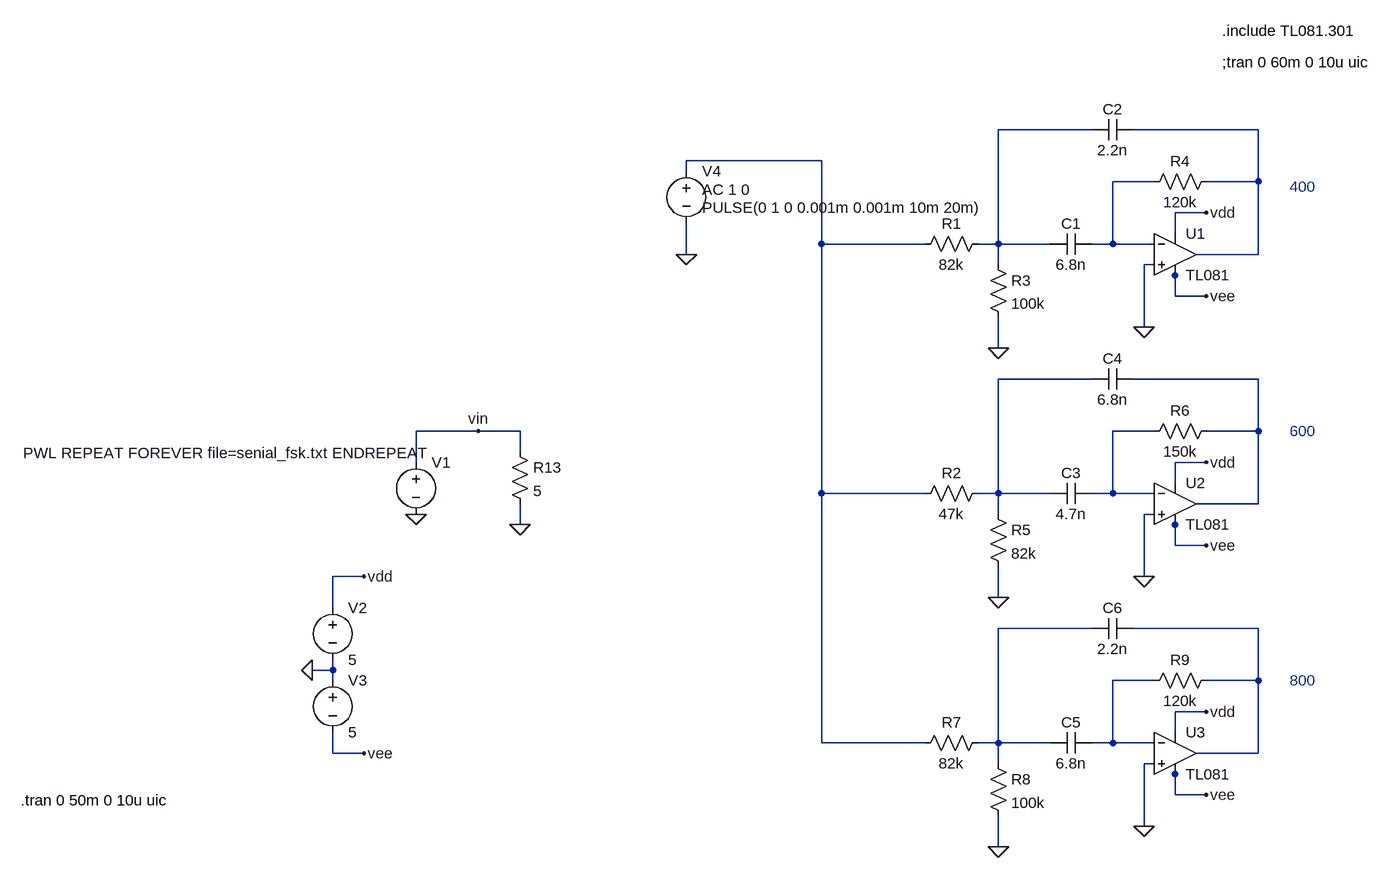
[diagram p0: schematic importar.asc]
importar.asc, the LTspice schematic file:
Version 4
SHEET 1 1032 836
WIRE -144 -544 -288 -544
WIRE 112 -544 -80 -544
WIRE -560 -496 -768 -496
WIRE -768 -480 -768 -496
WIRE -48 -464 -112 -464
WIRE 112 -464 112 -544
WIRE 112 -464 32 -464
WIRE 32 -416 -16 -416
WIRE -16 -384 -16 -416
WIRE -560 -368 -560 -496
WIRE -400 -368 -560 -368
WIRE -288 -368 -288 -544
WIRE -288 -368 -320 -368
WIRE -208 -368 -288 -368
WIRE -112 -368 -112 -464
WIRE -112 -368 -144 -368
WIRE -48 -368 -112 -368
WIRE -768 -352 -768 -400
WIRE 112 -352 112 -464
WIRE 112 -352 16 -352
WIRE -288 -336 -288 -368
WIRE -48 -336 -64 -336
WIRE -16 -320 -16 -336
WIRE -16 -288 -16 -320
WIRE 32 -288 -16 -288
WIRE -64 -240 -64 -336
WIRE -288 -208 -288 -256
WIRE -144 -160 -288 -160
WIRE 112 -160 -80 -160
WIRE -1088 -80 -1184 -80
WIRE -1024 -80 -1088 -80
WIRE -48 -80 -112 -80
WIRE 112 -80 112 -160
WIRE 112 -80 32 -80
WIRE -1024 -48 -1024 -80
WIRE -1184 -32 -1184 -80
WIRE 32 -32 -16 -32
WIRE -16 0 -16 -32
WIRE -560 16 -560 -368
WIRE -400 16 -560 16
WIRE -288 16 -288 -160
WIRE -288 16 -320 16
WIRE -208 16 -288 16
WIRE -112 16 -112 -80
WIRE -112 16 -144 16
WIRE -48 16 -112 16
WIRE 112 32 112 -80
WIRE 112 32 16 32
WIRE -288 48 -288 16
WIRE -48 48 -64 48
WIRE -1024 64 -1024 32
WIRE -16 64 -16 48
WIRE -16 96 -16 64
WIRE 32 96 -16 96
WIRE -1264 144 -1312 144
WIRE -64 144 -64 48
WIRE -288 176 -288 128
WIRE -1312 192 -1312 144
WIRE -144 224 -288 224
WIRE 112 224 -80 224
WIRE -1312 288 -1312 272
WIRE -1312 288 -1344 288
WIRE -1312 304 -1312 288
WIRE -48 304 -112 304
WIRE 112 304 112 224
WIRE 112 304 32 304
WIRE 32 352 -16 352
WIRE -16 384 -16 352
WIRE -560 400 -560 16
WIRE -400 400 -560 400
WIRE -288 400 -288 224
WIRE -288 400 -320 400
WIRE -208 400 -288 400
WIRE -112 400 -112 304
WIRE -112 400 -144 400
WIRE -48 400 -112 400
WIRE -1312 416 -1312 384
WIRE -1264 416 -1312 416
WIRE 112 416 112 304
WIRE 112 416 16 416
WIRE -288 432 -288 400
WIRE -48 432 -64 432
WIRE -16 448 -16 432
WIRE -16 480 -16 448
WIRE 32 480 -16 480
WIRE -64 528 -64 432
WIRE -288 560 -288 512
FLAG -1184 48 0
FLAG -1088 -80 vin
FLAG -1344 288 0
FLAG -1264 144 vdd
FLAG -1264 416 vee
FLAG -1024 64 0
FLAG -768 -352 0
FLAG -288 -208 0
FLAG -64 -240 0
FLAG 32 -416 vdd
FLAG 32 -288 vee
FLAG -288 176 0
FLAG -64 144 0
FLAG 32 -32 vdd
FLAG 32 96 vee
FLAG -288 560 0
FLAG -64 528 0
FLAG 32 352 vdd
FLAG 32 480 vee
SYMBOL voltage -1184 -48 R0
WINDOW 123 0 0 Left 2
WINDOW 39 0 0 Left 2
WINDOW 3 -604 2 Left 2
SYMATTR Value PWL REPEAT FOREVER file=senial_fsk.txt ENDREPEAT
SYMATTR InstName V1
SYMBOL voltage -1312 176 R0
WINDOW 123 0 0 Left 2
WINDOW 39 0 0 Left 2
SYMATTR InstName V2
SYMATTR Value 5
SYMBOL voltage -1312 288 R0
WINDOW 123 0 0 Left 2
WINDOW 39 0 0 Left 2
SYMATTR InstName V3
SYMATTR Value 5
SYMBOL res -1040 -64 R0
SYMATTR InstName R13
SYMATTR Value 5
SYMBOL voltage -768 -496 R0
WINDOW 123 24 44 Left 2
WINDOW 39 0 0 Left 2
WINDOW 3 24 72 Left 2
SYMATTR Value2 AC 1 0
SYMATTR Value PULSE(0 1 0 0.001m 0.001m 10m 20m)
SYMATTR InstName V4
SYMBOL res -304 -384 R90
WINDOW 0 0 56 VBottom 2
WINDOW 3 32 56 VTop 2
SYMATTR InstName R1
SYMATTR Value 82k
SYMBOL res -304 -352 R0
SYMATTR InstName R3
SYMATTR Value 100k
SYMBOL cap -144 -384 R90
WINDOW 0 0 32 VBottom 2
WINDOW 3 32 32 VTop 2
SYMATTR InstName C1
SYMATTR Value 6.8n
SYMBOL Opamps\\opamp2 -16 -416 R0
SYMATTR InstName U1
SYMATTR Value TL081
SYMBOL res 48 -480 R90
WINDOW 0 0 56 VBottom 2
WINDOW 3 32 56 VTop 2
SYMATTR InstName R4
SYMATTR Value 120k
SYMBOL cap -80 -560 R90
WINDOW 0 0 32 VBottom 2
WINDOW 3 32 32 VTop 2
SYMATTR InstName C2
SYMATTR Value 2.2n
SYMBOL res -304 0 R90
WINDOW 0 0 56 VBottom 2
WINDOW 3 32 56 VTop 2
SYMATTR InstName R2
SYMATTR Value 47k
SYMBOL res -304 32 R0
SYMATTR InstName R5
SYMATTR Value 82k
SYMBOL cap -144 0 R90
WINDOW 0 0 32 VBottom 2
WINDOW 3 32 32 VTop 2
SYMATTR InstName C3
SYMATTR Value 4.7n
SYMBOL Opamps\\opamp2 -16 -32 R0
SYMATTR InstName U2
SYMATTR Value TL081
SYMBOL res 48 -96 R90
WINDOW 0 0 56 VBottom 2
WINDOW 3 32 56 VTop 2
SYMATTR InstName R6
SYMATTR Value 150k
SYMBOL cap -80 -176 R90
WINDOW 0 0 32 VBottom 2
WINDOW 3 32 32 VTop 2
SYMATTR InstName C4
SYMATTR Value 6.8n
SYMBOL res -304 384 R90
WINDOW 0 0 56 VBottom 2
WINDOW 3 32 56 VTop 2
SYMATTR InstName R7
SYMATTR Value 82k
SYMBOL res -304 416 R0
SYMATTR InstName R8
SYMATTR Value 100k
SYMBOL cap -144 384 R90
WINDOW 0 0 32 VBottom 2
WINDOW 3 32 32 VTop 2
SYMATTR InstName C5
SYMATTR Value 6.8n
SYMBOL Opamps\\opamp2 -16 352 R0
SYMATTR InstName U3
SYMATTR Value TL081
SYMBOL res 48 288 R90
WINDOW 0 0 56 VBottom 2
WINDOW 3 32 56 VTop 2
SYMATTR InstName R9
SYMATTR Value 120k
SYMBOL cap -80 208 R90
WINDOW 0 0 32 VBottom 2
WINDOW 3 32 32 VTop 2
SYMATTR InstName C6
SYMATTR Value 2.2n
TEXT 56 -648 Left 2 !;tran 0 60m 0 10u uic
TEXT 56 -696 Left 2 !.include TL081.301
TEXT -1792 488 Left 2 !.tran 0 50m 0 10u uic
TEXT 160 -456 Left 2 ;400
TEXT 160 -80 Left 2 ;600
TEXT 160 304 Left 2 ;800

The netlist it stands for:
* importar.asc
V1 vin 0 PWL REPEAT FOREVER file=senial_fsk.txt ENDREPEAT
V2 vdd 0 5
V3 0 vee 5
R13 vin 0 5
V4 N003 0 PULSE(0 1 0 0.001m 0.001m 10m 20m) AC 1 0
R1 N001 N003 82k
R3 N001 0 100k
C1 N004 N001 6.8n
XU1 0 N004 vdd vee N002 TL081  ; pins In+ In- V+ V- OUT
R4 N002 N004 120k
C2 N002 N001 2.2n
R2 N005 N003 47k
R5 N005 0 82k
C3 N007 N005 4.7n
XU2 0 N007 vdd vee N006 TL081  ; pins In+ In- V+ V- OUT
R6 N006 N007 150k
C4 N006 N005 6.8n
R7 N008 N003 82k
R8 N008 0 100k
C5 N010 N008 6.8n
XU3 0 N010 vdd vee N009 TL081  ; pins In+ In- V+ V- OUT
R9 N009 N010 120k
C6 N009 N008 2.2n
;tran 0 60m 0 10u uic
.include TL081.301
.tran 0 50m 0 10u uic
* 400
* 600
* 800
.backanno
.end

* Results of the author's LTspice run, read from the files saved beside the schematic
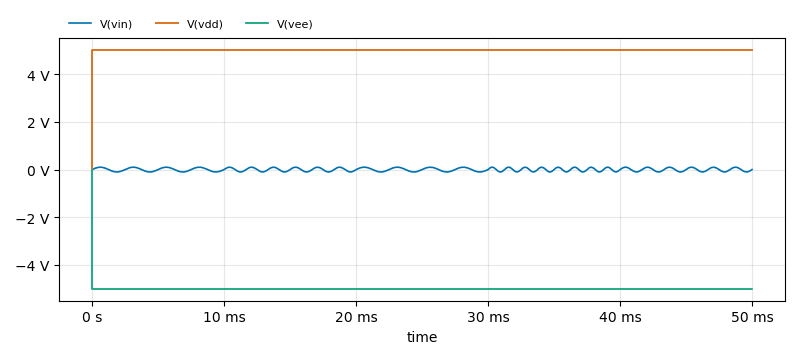
[diagram p1: Transient Analysis of importar.asc, plotted from the saved traces]
* Transient Analysis, 1 run:
*   V(vin): min -99.99 mV, max 99.99 mV, average 10.88 µV, rms 70.06 mV, last 0 V
*   V(vdd): min 0 V, max 5 V, average 5 V, rms 5 V, last 5 V
*   V(vee): min -5 V, max 0 V, average -5 V, rms 5 V, last -5 V